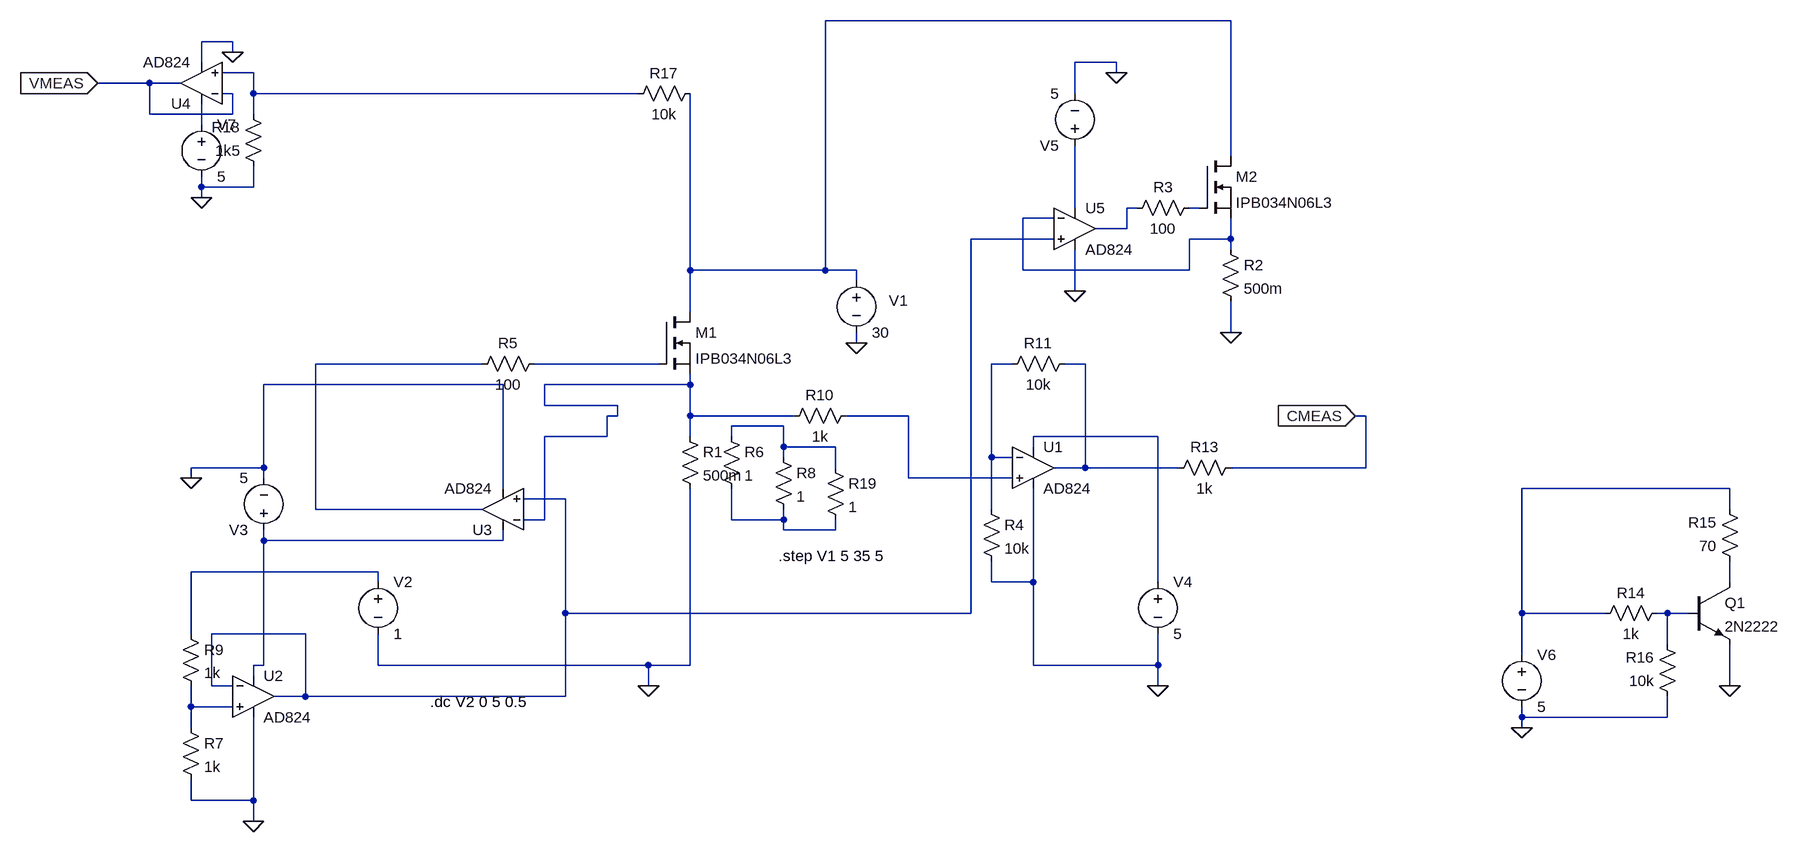
[diagram p0: schematic electronic-load2.asc]
electronic-load2.asc, the LTspice schematic file:
Version 4
SHEET 1 1848 724
WIRE 992 -528 368 -528
WIRE -544 -496 -592 -496
WIRE -544 -480 -544 -496
WIRE -592 -464 -592 -496
WIRE 816 -464 752 -464
WIRE -512 -448 -560 -448
WIRE 816 -448 816 -464
WIRE -672 -432 -752 -432
WIRE -624 -432 -672 -432
WIRE -544 -416 -560 -416
WIRE -512 -416 -512 -448
WIRE 80 -416 -512 -416
WIRE 752 -416 752 -464
WIRE -672 -384 -672 -432
WIRE -544 -384 -544 -416
WIRE -544 -384 -672 -384
WIRE -512 -384 -512 -416
WIRE -592 -368 -592 -400
WIRE 992 -320 992 -528
WIRE -592 -272 -592 -288
WIRE -512 -272 -512 -304
WIRE -512 -272 -592 -272
WIRE -592 -256 -592 -272
WIRE 752 -240 752 -336
WIRE 848 -240 832 -240
WIRE 944 -240 928 -240
WIRE 720 -224 672 -224
WIRE 832 -208 832 -240
WIRE 832 -208 784 -208
WIRE 720 -192 592 -192
WIRE 992 -192 992 -224
WIRE 992 -192 928 -192
WIRE 992 -176 992 -192
WIRE 160 -144 160 -416
WIRE 368 -144 368 -528
WIRE 368 -144 160 -144
WIRE 416 -144 368 -144
WIRE 672 -144 672 -224
WIRE 928 -144 928 -192
WIRE 928 -144 672 -144
WIRE 416 -128 416 -144
WIRE 752 -112 752 -176
WIRE 160 -80 160 -144
WIRE 992 -48 992 -96
WIRE 416 -32 416 -48
WIRE -160 0 -416 0
WIRE 112 0 -80 0
WIRE 656 0 624 0
WIRE 768 0 736 0
WIRE -128 32 -496 32
WIRE 160 32 160 16
WIRE 160 32 -64 32
WIRE -64 64 -64 32
WIRE 48 64 -64 64
WIRE 48 80 48 64
WIRE 48 80 32 80
WIRE 160 80 160 32
WIRE 320 80 160 80
WIRE 496 80 400 80
WIRE 1200 80 1184 80
WIRE 304 96 224 96
WIRE 32 112 32 80
WIRE 32 112 -64 112
WIRE 160 112 160 80
WIRE 224 112 224 96
WIRE 880 112 688 112
WIRE 304 128 304 96
WIRE 384 128 304 128
WIRE 688 128 688 112
WIRE 304 144 304 128
WIRE 624 144 624 0
WIRE 656 144 624 144
WIRE -496 160 -496 32
WIRE -496 160 -608 160
WIRE 384 160 384 128
WIRE 768 160 768 0
WIRE 768 160 720 160
WIRE 912 160 768 160
WIRE 1200 160 1200 80
WIRE 1200 160 992 160
WIRE -608 176 -608 160
WIRE -496 176 -496 160
WIRE 496 176 496 80
WIRE 656 176 496 176
WIRE -128 192 -128 32
WIRE 1760 192 1440 192
WIRE -32 208 -96 208
WIRE -416 224 -416 0
WIRE -160 224 -416 224
WIRE 624 224 624 144
WIRE 1760 224 1760 192
WIRE -64 240 -64 112
WIRE -64 240 -96 240
WIRE 224 240 224 192
WIRE 304 240 304 224
WIRE 304 240 224 240
WIRE 304 256 304 240
WIRE 384 256 384 240
WIRE 384 256 304 256
WIRE -496 272 -496 256
WIRE -128 272 -128 256
WIRE -128 272 -496 272
WIRE -320 320 -608 320
WIRE -320 336 -320 320
WIRE 624 336 624 304
WIRE 688 336 688 192
WIRE 688 336 624 336
WIRE 880 336 880 112
WIRE 1760 336 1760 304
WIRE -32 384 -32 208
WIRE 592 384 592 -192
WIRE 592 384 -32 384
WIRE 1440 384 1440 192
WIRE 1568 384 1440 384
WIRE 1664 384 1648 384
WIRE 1696 384 1664 384
WIRE -608 416 -608 320
WIRE -432 416 -576 416
WIRE 1664 432 1664 384
WIRE 1440 448 1440 384
WIRE -496 464 -496 272
WIRE -496 464 -512 464
WIRE -320 464 -320 416
WIRE 96 464 -320 464
WIRE 160 464 160 192
WIRE 160 464 96 464
WIRE 688 464 688 336
WIRE 880 464 880 416
WIRE 880 464 688 464
WIRE -512 480 -512 464
WIRE -576 496 -576 416
WIRE -544 496 -576 496
WIRE 96 496 96 464
WIRE 880 496 880 464
WIRE 1760 496 1760 432
WIRE -432 512 -432 416
WIRE -432 512 -480 512
WIRE -32 512 -32 384
WIRE -32 512 -432 512
WIRE -608 528 -608 496
WIRE -544 528 -608 528
WIRE 1440 544 1440 528
WIRE 1664 544 1664 512
WIRE 1664 544 1440 544
WIRE -608 560 -608 528
WIRE 1440 560 1440 544
WIRE -608 672 -608 640
WIRE -512 672 -512 544
WIRE -512 672 -608 672
WIRE -512 704 -512 672
FLAG 96 496 0
FLAG -608 176 0
FLAG 880 496 0
FLAG 416 -32 0
FLAG 1184 80 CMEAS
IOPIN 1184 80 In
FLAG -512 704 0
FLAG 1760 496 0
FLAG 1440 560 0
FLAG -544 -480 0
FLAG -592 -256 0
FLAG -752 -432 VMEAS
IOPIN -752 -432 In
FLAG 992 -48 0
FLAG 752 -112 0
FLAG 816 -448 0
SYMBOL voltage 416 -144 R0
WINDOW 123 0 0 Left 0
WINDOW 39 0 0 Left 0
WINDOW 0 50 47 Left 2
SYMATTR InstName V1
SYMATTR Value 30
SYMBOL voltage -320 320 R0
WINDOW 123 0 0 Left 0
WINDOW 39 0 0 Left 0
SYMATTR InstName V2
SYMATTR Value 1
SYMBOL res 144 96 R0
SYMATTR InstName R1
SYMATTR Value 500m
SYMBOL voltage -496 272 R180
WINDOW 123 0 0 Left 0
WINDOW 39 0 0 Left 0
SYMATTR InstName V3
SYMATTR Value 5
SYMBOL voltage 880 320 R0
WINDOW 123 0 0 Left 0
WINDOW 39 0 0 Left 0
SYMATTR InstName V4
SYMATTR Value 5
SYMBOL res -64 -16 R90
WINDOW 0 0 56 VBottom 2
WINDOW 3 32 56 VTop 2
SYMATTR InstName R5
SYMATTR Value 100
SYMBOL Opamps\\AD824 -128 288 R180
SYMATTR InstName U3
SYMBOL res 304 96 R270
WINDOW 0 32 56 VTop 2
WINDOW 3 0 56 VBottom 2
SYMATTR InstName R10
SYMATTR Value 1k
SYMBOL res 640 16 R270
WINDOW 0 32 56 VTop 2
WINDOW 3 0 56 VBottom 2
SYMATTR InstName R11
SYMATTR Value 10k
SYMBOL res 608 208 R0
SYMATTR InstName R4
SYMATTR Value 10k
SYMBOL Opamps\\AD824 688 96 R0
SYMATTR InstName U1
SYMBOL Opamps\\AD824 -512 448 R0
SYMATTR InstName U2
SYMBOL res -624 544 R0
SYMATTR InstName R7
SYMATTR Value 1k
SYMBOL res 1008 144 R90
WINDOW 0 0 56 VBottom 2
WINDOW 3 32 56 VTop 2
SYMATTR InstName R13
SYMATTR Value 1k
SYMBOL npn 1696 336 R0
SYMATTR InstName Q1
SYMATTR Value 2N2222
SYMBOL res 1664 368 R90
WINDOW 0 0 56 VBottom 2
WINDOW 3 32 56 VTop 2
SYMATTR InstName R14
SYMATTR Value 1k
SYMBOL voltage 1440 432 R0
WINDOW 123 0 0 Left 0
WINDOW 39 0 0 Left 0
SYMATTR InstName V6
SYMATTR Value 5
SYMBOL res 1776 320 R180
WINDOW 0 36 76 Left 2
WINDOW 3 36 40 Left 2
SYMATTR InstName R15
SYMATTR Value 70
SYMBOL res 1680 528 R180
WINDOW 0 36 76 Left 2
WINDOW 3 36 40 Left 2
SYMATTR InstName R16
SYMATTR Value 10k
SYMBOL Opamps\\AD824 -592 -368 R180
SYMATTR InstName U4
SYMBOL res 176 -432 R90
WINDOW 0 0 56 VBottom 2
WINDOW 3 32 56 VTop 2
SYMATTR InstName R17
SYMATTR Value 10k
SYMBOL res -496 -288 R180
WINDOW 0 36 76 Left 2
WINDOW 3 36 40 Left 2
SYMATTR InstName R18
SYMATTR Value 1k5
SYMBOL voltage -592 -384 R0
WINDOW 123 0 0 Left 0
WINDOW 39 0 0 Left 0
SYMATTR InstName V7
SYMATTR Value 5
SYMBOL res 208 96 R0
SYMATTR InstName R6
SYMATTR Value 1
SYMBOL res 288 128 R0
SYMATTR InstName R8
SYMATTR Value 1
SYMBOL res 368 144 R0
SYMATTR InstName R19
SYMATTR Value 1
SYMBOL nmos 112 -80 R0
SYMATTR InstName M1
SYMATTR Value IPB034N06L3
SYMBOL Opamps\\AD824 752 -272 R0
SYMATTR InstName U5
SYMBOL res 976 -192 R0
SYMATTR InstName R2
SYMATTR Value 500m
SYMBOL nmos 944 -320 R0
SYMATTR InstName M2
SYMATTR Value IPB034N06L3
SYMBOL res 944 -256 R90
WINDOW 0 0 56 VBottom 2
WINDOW 3 32 56 VTop 2
SYMATTR InstName R3
SYMATTR Value 100
SYMBOL voltage 752 -320 R180
WINDOW 123 0 0 Left 0
WINDOW 39 0 0 Left 0
SYMATTR InstName V5
SYMATTR Value 5
SYMBOL res -624 400 R0
SYMATTR InstName R9
SYMATTR Value 1k
TEXT -240 520 Left 2 !.dc V2 0 5 0.5
TEXT 296 296 Left 2 !.step V1 5 35 5

The netlist it stands for:
* electronic-load2.asc
V1 N001 0 30
V2 N020 0 1
R1 N013 0 500m
V3 N019 0 5
V4 N016 0 5
R5 N010 N009 100
XU3 N008 N013 N019 0 N009 AD824  ; pins In+ In- V+ V- OUT
R10 N013 N014 1k
R11 N011 N012 10k
R4 N011 0 10k
XU1 N014 N011 N016 0 N012 AD824  ; pins In+ In- V+ V- OUT
XU2 N023 N008 N019 0 N008 AD824  ; pins In+ In- V+ V- OUT
R7 N023 0 1k
R13 CMEAS N012 1k
Q1 N021 N022 0 0 2N2222
R14 N022 N017 1k
V6 N017 0 5
R15 N021 N017 70
R16 0 N022 10k
XU4 N002 VMEAS N003 0 VMEAS AD824  ; pins In+ In- V+ V- OUT
R17 N001 N002 10k
R18 0 N002 1k5
V7 N003 0 5
R6 N015 N018 1
R8 N015 N018 1
R19 N015 N018 1
M1 N001 N010 N013 N013 IPB034N06L3
XU5 N008 N007 N004 0 N005 AD824  ; pins In+ In- V+ V- OUT
R2 N007 0 500m
M2 N001 N006 N007 N007 IPB034N06L3
R3 N006 N005 100
V5 N004 0 5
R9 N020 N023 1k
.model NPN NPN
.model PNP PNP
.lib standard.bjt
.model NMOS NMOS
.model PMOS PMOS
.lib standard.mos
.dc V2 0 5 0.5
.step V1 5 35 5
.backanno
.end

* Results of the author's LTspice run, read from the files saved beside the schematic
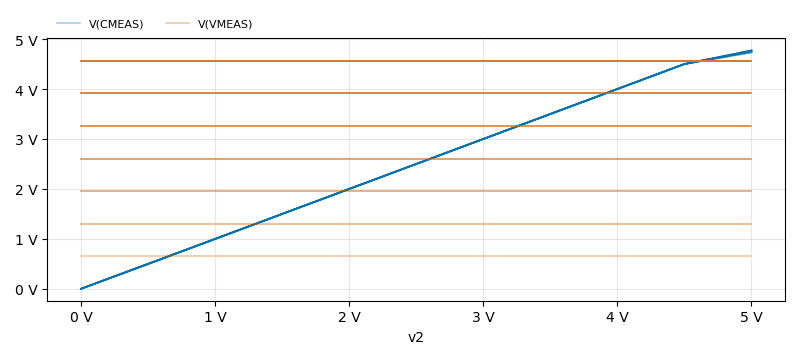
[diagram p1: DC transfer characteristic of electronic-load2.asc, plotted from the saved traces]
* DC transfer characteristic, 7 runs:
*   V(CMEAS) [v1=5]: 2.367 mV at v2=0 V, 4.725 V at v2=5 V, min 2.367 mV, max 4.725 V
*   V(CMEAS) [v1=10]: 2.367 mV at v2=0 V, 4.734 V at v2=5 V, min 2.367 mV, max 4.734 V
*   V(CMEAS) [v1=15]: 2.367 mV at v2=0 V, 4.743 V at v2=5 V, min 2.367 mV, max 4.743 V
*   V(CMEAS) [v1=20]: 2.367 mV at v2=0 V, 4.751 V at v2=5 V, min 2.367 mV, max 4.751 V
*   V(CMEAS) [v1=25]: 2.367 mV at v2=0 V, 4.759 V at v2=5 V, min 2.367 mV, max 4.759 V
*   V(CMEAS) [v1=30]: 2.367 mV at v2=0 V, 4.766 V at v2=5 V, min 2.367 mV, max 4.766 V
*   V(CMEAS) [v1=35]: 2.367 mV at v2=0 V, 4.773 V at v2=5 V, min 2.367 mV, max 4.773 V
*   V(VMEAS) [v1=5]: 652.2 mV at v2=0 V, 652.2 mV at v2=5 V, min 652.2 mV, max 652.2 mV
*   V(VMEAS) [v1=10]: 1.304 V at v2=0 V, 1.304 V at v2=5 V, min 1.304 V, max 1.304 V
*   V(VMEAS) [v1=15]: 1.957 V at v2=0 V, 1.957 V at v2=5 V, min 1.957 V, max 1.957 V
*   V(VMEAS) [v1=20]: 2.609 V at v2=0 V, 2.609 V at v2=5 V, min 2.609 V, max 2.609 V
*   V(VMEAS) [v1=25]: 3.261 V at v2=0 V, 3.261 V at v2=5 V, min 3.261 V, max 3.261 V
*   V(VMEAS) [v1=30]: 3.913 V at v2=0 V, 3.913 V at v2=5 V, min 3.913 V, max 3.913 V
*   V(VMEAS) [v1=35]: 4.565 V at v2=0 V, 4.565 V at v2=5 V, min 4.565 V, max 4.565 V